# Altium project FPGA_Project.PrjPcb
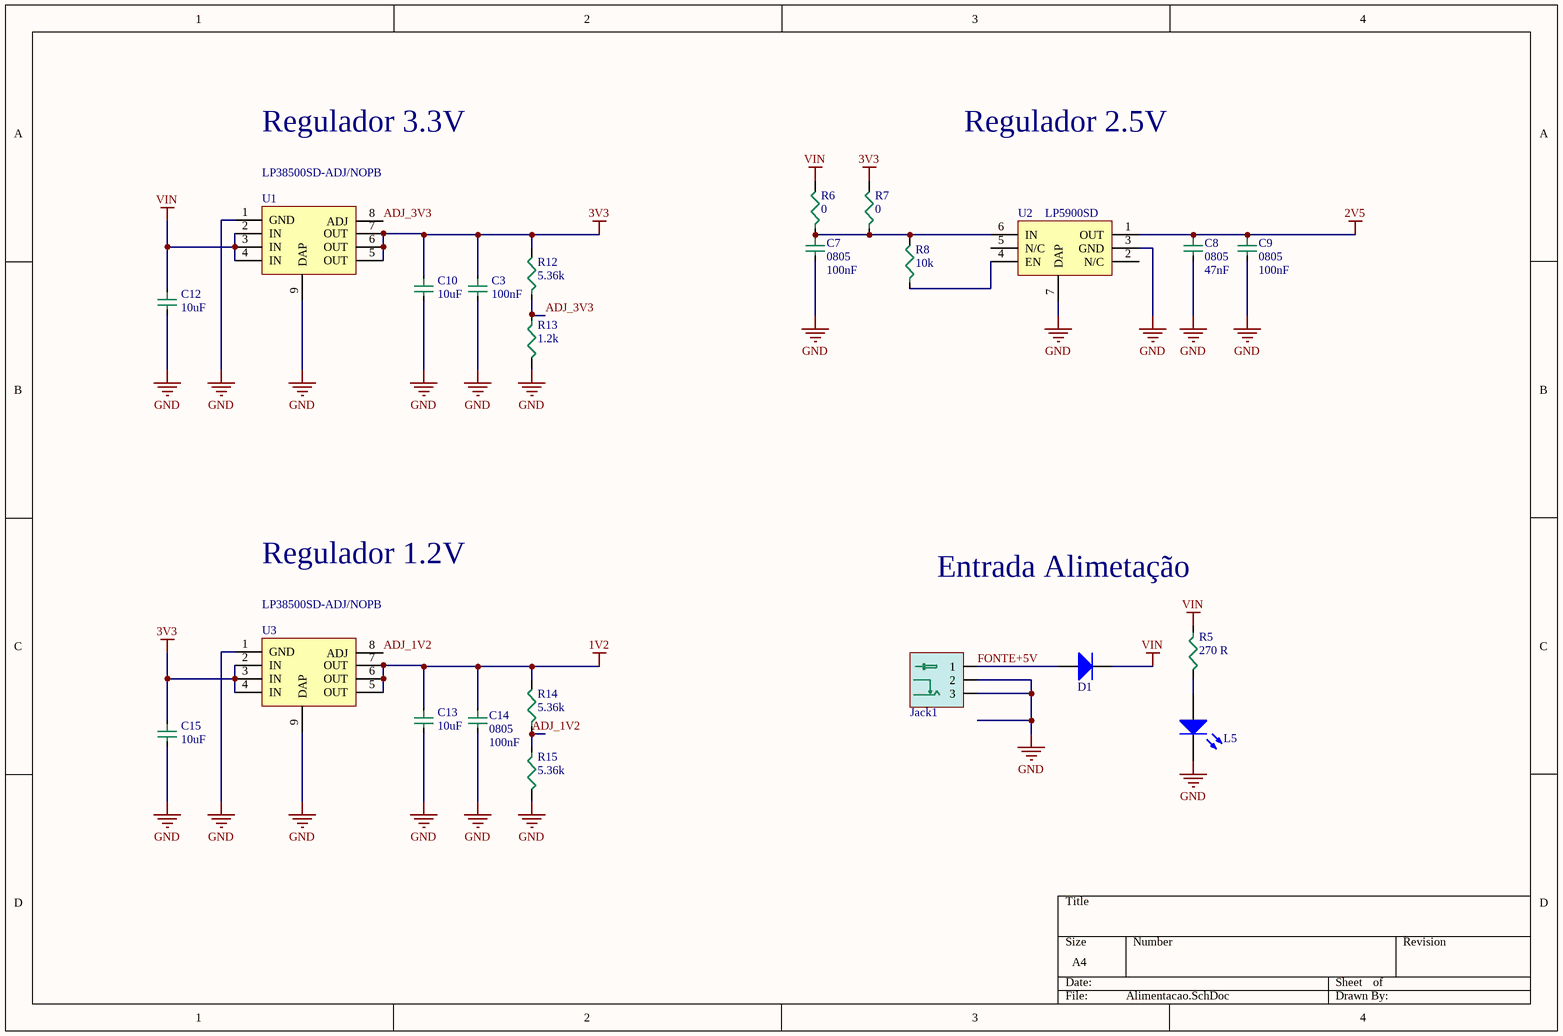
[diagram p0: Alimentacao.SchDoc]
5 sheets, 116 parts. Net scope: global (net labels, ports and power ports of the same name join across sheets).
Board files: PAINEL.PcbDoc, PCB1.PcbDoc
Sheets:
  Alimentacao.SchDoc
  DSP's.SchDoc
  FPGA.SchDoc
  Geral.SchDoc
  Perifericos_Schematic.SchDoc

## Sheet Alimentacao.SchDoc
size A4

### Parts
C3  value 100nF  [0603C]  (hidden comment: 0603)
C7  0805  value 100nF  [0603C]
C8  0805  value 47nF  [0603C]
C9  0805  value 100nF  [0603C]
C10  value 10uF  [0603C]  (hidden comment: 0603)
C12  value 10uF  [0603C]  (hidden comment: 0603)
C13  value 10uF  [0603C]  (hidden comment: 0603)
C14  0805  value 100nF  [0603C]
C15  value 10uF  [0603C]  (hidden comment: 0603)
D1  Diodo_1  [SOD123]  (value not drawn)
Jack1  DC Supply Jack  [CON_DC_POWER_JACK]  (value not drawn)
L5  LED 0805  [LED SMD 0603]  (value not drawn)
R5  value 270 R  [0603]  (hidden comment: 0805)
R6  value 0  [0603]  (hidden comment: 0805)
R7  value 0  [0603]  (hidden comment: 0805)
R8  value 10k  [0603]  (hidden comment: 0805)
R12  value 5.36k  [0603]  (hidden comment: 0805)
R13  value 1.2k  [0603]  (hidden comment: 0805)
R14  value 5.36k  [0603]  (hidden comment: 0805)
R15  value 5.36k  [0603]  (hidden comment: 0805)
U1  LP38500SD-ADJ/NOPB  [8-WFDFN]
U2  LP5900SD  [6-WFDFN]
U3  LP38500SD-ADJ/NOPB  [8-WFDFN]

### Nets
1V2: C13.1 C14.1 R14.2 U3.5(OUT) U3.6(OUT) U3.7(OUT)
2V5: C8.1 C9.1 U2.1(OUT)
3V3: C3.1 C10.1 C15.1 R7.2 R12.2 U1.5(OUT) U1.6(OUT) U1.7(OUT) U3.2(IN) U3.3(IN) U3.4(IN)
GND: C3.2 C7.2 C8.2 C9.2 C10.2 C12.2 C13.2 C14.2 C15.2 Jack1.2 Jack1.3 L5.2(K) R13.2 R15.2 U1.1(GND) U1.9(DAP) U2.3(GND) U2.7(DAP) U3.1(GND) U3.9(DAP)
VIN: C12.1 D1.2(K) R5.1 R6.2 U1.2(IN) U1.3(IN) U1.4(IN)
ADJ_1V2: R14.1 R15.1 U3.8(ADJ)
ADJ_3V3: R12.1 R13.1 U1.8(ADJ)
FONTE+5V: D1.1(A) Jack1.1
NetC7_1: C7.1 R6.1 R7.1 R8.2 U2.6(IN)
NetL5_1: L5.1(A) R5.2
NetR8_1: R8.1 U2.4(EN)

Not connected (* = marked no-connect by the designer): U2 2(N/C) 5(N/C)

### Notes on the sheet
- Regulador 3.3V
- Regulador 2.5V
- Regulador 1.2V
- Entrada Alimetação

### Library data of the parts
C3 C7-C10 C12-C15 = Capacitor SMD 0603
D1 = Diodo_1: DIODE SCHOTTKY 20V 0.5A SOD123; Supplier 1: Digi-Key; Supplier Part Number 1: MBR0520LCT-ND
Jack1 = DC_Power_connector
L5 = LED 0603 SMD: Typical INFRARED GaAs LED; Published: 8-Jun-2000; LatestRevisionDate: 08-Jul-2005; LatestRevisionNote: Mech Layer 1 removed.; PackageReference: LED-0; Publisher: Altium Limited
R5-R8 R12-R15 = Resistor SMD 0603 1/10 W: %: ±1%; P: 1/8W
U1 U3 = LP38500SD-ADJ/NOPB: 1.5-A Flexcap Low-Dropout Linear Regulator; Published: 26-Mar-2019; LatestRevisionDate: 26-Mar-2019; LatestRevisionNote: IPC-7351 Footprint Added.; DatasheetVersion: Sept-2015; PackageVersion: Nov-2007; PackageReference: e 8-WSON (3x2.5); Publisher: Altium Limited; PackageDescription: 8-WFDFN Exposed Pad; ComponentLink1Description: Manufacturer Link; ComponentLink1URL: http://www.ti.com/lit/ds/symlink/lp38500-adj.pdf
U2 = LP5900SD-2.5/NOPB: 1.5-A Flexcap Low-Dropout Linear Regulator; Published: 26-Mar-2019; LatestRevisionDate: 26-Mar-2019; LatestRevisionNote: IPC-7351 Footprint Added.; DatasheetVersion: june-2016; PackageVersion: Nov-2007; PackageReference: 6-WSON (3x2.5); Publisher: Altium Limited; PackageDescription: 6-WFDFN Exposed Pad; ComponentLink1Description: Manufacturer Link; ComponentLink1URL: http://www.ti.com/lit/ds/symlink/lp38500-adj.pdf

## Sheet DSP's.SchDoc
size A4
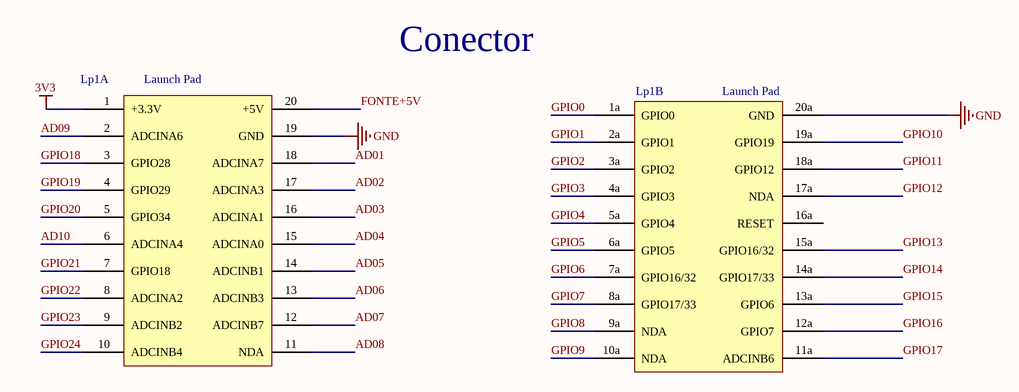
[diagram p1: DSP's.SchDoc]

### Parts
Lp1  Launch Pad  [LAUNCHPAD_28xxx]  (parts A,B of 2)

### Nets
3V3: Lp1.1(+3.3V)
GND: Lp1.19(GND) Lp1.20a(GND)
AD01: Lp1.18(ADCINA7)
AD02: Lp1.17(ADCINA3)
AD03: Lp1.16(ADCINA1)
AD04: Lp1.15(ADCINA0)
AD05: Lp1.14(ADCINB1)
AD06: Lp1.13(ADCINB3)
AD07: Lp1.12(ADCINB7)
AD08: Lp1.11(NDA)
AD09: Lp1.2(ADCINA6)
AD10: Lp1.6(ADCINA4)
FONTE+5V: Lp1.20(+5V)
GPIO0: Lp1.1a(GPIO0)
GPIO1: Lp1.2a(GPIO1)
GPIO2: Lp1.3a(GPIO2)
GPIO3: Lp1.4a(GPIO3)
GPIO4: Lp1.5a(GPIO4)
GPIO5: Lp1.6a(GPIO5)
GPIO6: Lp1.7a(GPIO16/32)
GPIO7: Lp1.8a(GPIO17/33)
GPIO8: Lp1.9a(NDA)
GPIO9: Lp1.10a(NDA)
GPIO10: Lp1.19a(GPIO19)
GPIO11: Lp1.18a(GPIO12)
GPIO12: Lp1.17a(NDA)
GPIO13: Lp1.15a(GPIO16/32)
GPIO14: Lp1.14a(GPIO17/33)
GPIO15: Lp1.13a(GPIO6)
GPIO16: Lp1.12a(GPIO7)
GPIO17: Lp1.11a(ADCINB6)
GPIO18: Lp1.3(GPIO28)
GPIO19: Lp1.4(GPIO29)
GPIO20: Lp1.5(GPIO34)
GPIO21: Lp1.7(GPIO18)
GPIO22: Lp1.8(ADCINA2)
GPIO23: Lp1.9(ADCINB2)
GPIO24: Lp1.10(ADCINB4)

Not connected (* = marked no-connect by the designer): Lp1 16a(RESET)

### Notes on the sheet
- Conector

### Library data of the parts
Lp1 = LaunchPad_28xxx

## Sheet FPGA.SchDoc
size A4
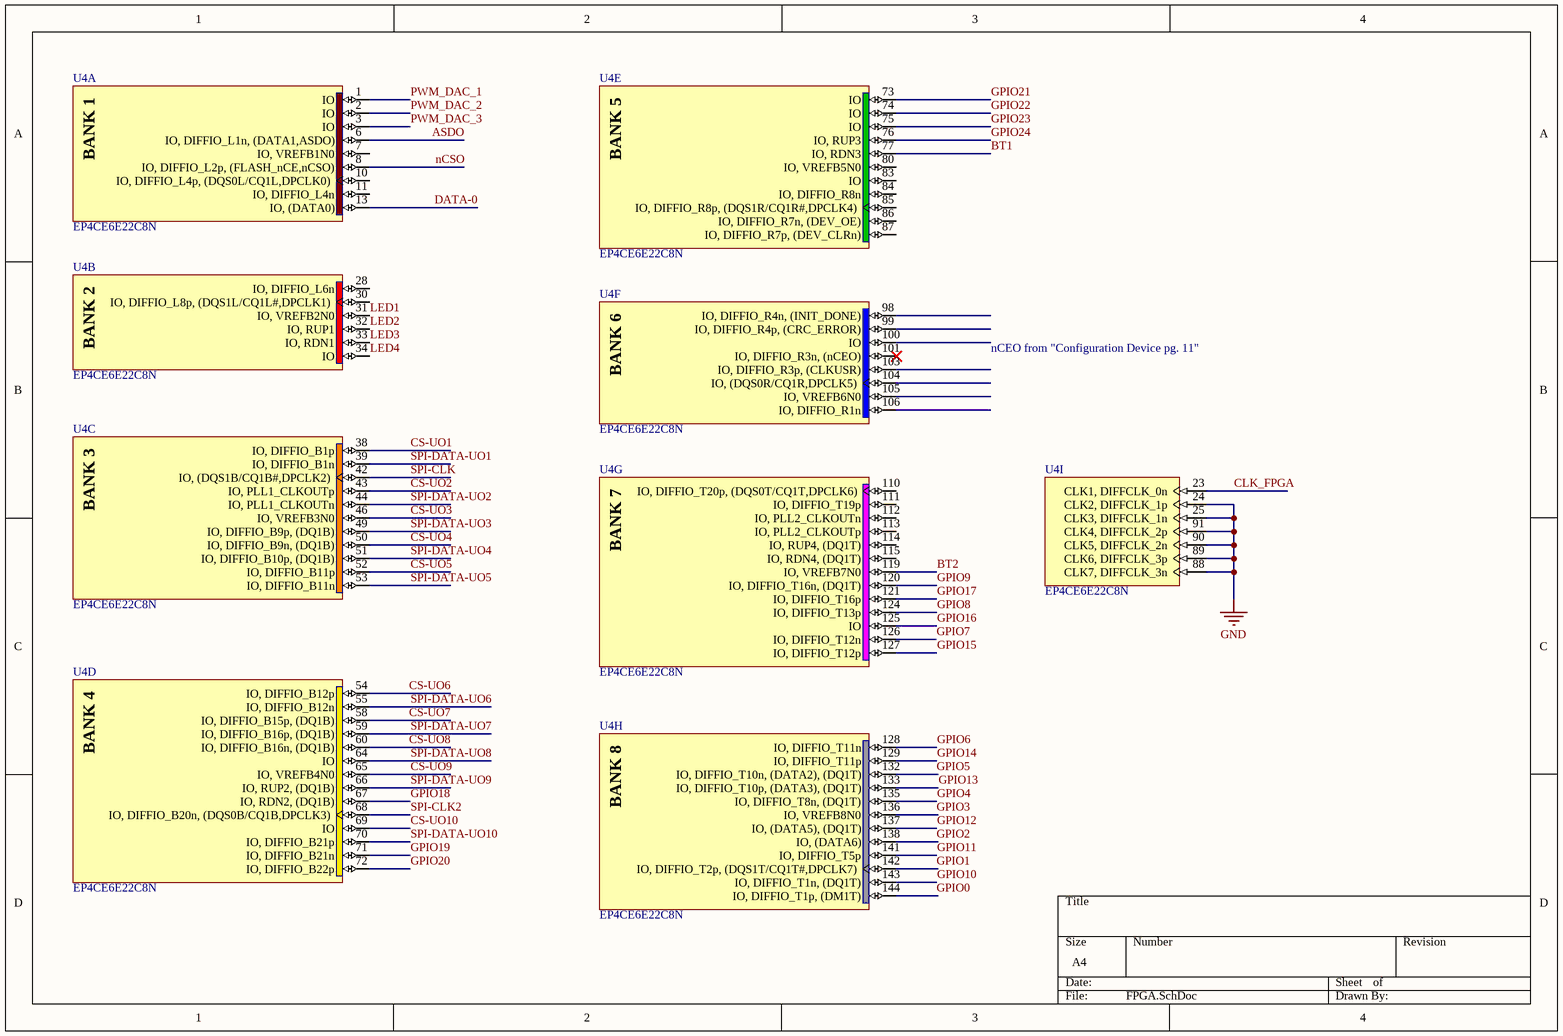
[diagram p2: FPGA.SchDoc]

### Parts
U4  EP4CE6E22C8N  [EQFP144_M]  (parts A,B,C,D,E,F,G,H,I of 13)

### Nets
GND: U4.24(CLK2,_DIFFCLK_1p) U4.25(CLK3,_DIFFCLK_1n) U4.88(CLK7,_DIFFCLK_3n) U4.89(CLK6,_DIFFCLK_3p) U4.90(CLK5,_DIFFCLK_2n) U4.91(CLK4,_DIFFCLK_2p)
ASDO: U4.6(IO,_DIFFIO_L1n,_(DATA1,ASDO))
BT1: U4.77(IO,_RDN3)
BT2: U4.119(IO,_VREFB7N0)
CLK_FPGA: U4.23(CLK1,_DIFFCLK_0n)
CS-UO1: U4.38(IO,_DIFFIO_B1p)
CS-UO2: U4.43(IO,_PLL1_CLKOUTp)
CS-UO3: U4.46(IO,_VREFB3N0)
CS-UO4: U4.50(IO,_DIFFIO_B9n,_(DQ1B))
CS-UO5: U4.52(IO,_DIFFIO_B11p)
CS-UO6: U4.54(IO,_DIFFIO_B12p)
CS-UO7: U4.58(IO,_DIFFIO_B15p,_(DQ1B))
CS-UO8: U4.60(IO,_DIFFIO_B16n,_(DQ1B))
CS-UO9: U4.65(IO,_VREFB4N0)
CS-UO10: U4.69(IO)
DATA-0: U4.13(IO,_(DATA0))
GPIO0: U4.144(IO,_DIFFIO_T1p,_(DM1T))
GPIO1: U4.142(IO,_DIFFIO_T2p,_(DQS1T/CQ1T#,DPCLK7))
GPIO2: U4.138(IO,_(DATA6))
GPIO3: U4.136(IO,_VREFB8N0)
GPIO4: U4.135(IO,_DIFFIO_T8n,_(DQ1T))
GPIO5: U4.132(IO,_DIFFIO_T10n,_(DATA2),_(DQ1T))
GPIO6: U4.128(IO,_DIFFIO_T11n)
GPIO7: U4.126(IO,_DIFFIO_T12n)
GPIO8: U4.124(IO,_DIFFIO_T13p)
GPIO9: U4.120(IO,_DIFFIO_T16n,_(DQ1T))
GPIO10: U4.143(IO,_DIFFIO_T1n,_(DQ1T))
GPIO11: U4.141(IO,_DIFFIO_T5p)
GPIO12: U4.137(IO,_(DATA5),_(DQ1T))
GPIO13: U4.133(IO,_DIFFIO_T10p,_(DATA3),_(DQ1T))
GPIO14: U4.129(IO,_DIFFIO_T11p)
GPIO15: U4.127(IO,_DIFFIO_T12p)
GPIO16: U4.125(IO)
GPIO17: U4.121(IO,_DIFFIO_T16p)
GPIO18: U4.67(IO,_RDN2,_(DQ1B))
GPIO19: U4.71(IO,_DIFFIO_B21n)
GPIO20: U4.72(IO,_DIFFIO_B22p)
GPIO21: U4.73(IO)
GPIO22: U4.74(IO)
GPIO23: U4.75(IO)
GPIO24: U4.76(IO,_RUP3)
LED1: U4.31(IO,_VREFB2N0)
LED2: U4.32(IO,_RUP1)
LED3: U4.33(IO,_RDN1)
LED4: U4.34(IO)
nCSO: U4.8(IO,_DIFFIO_L2p,_(FLASH_nCE,nCSO))
PWM_DAC_1: U4.1(IO)
PWM_DAC_2: U4.2(IO)
PWM_DAC_3: U4.3(IO)
SPI-CLK: U4.42(IO,_(DQS1B/CQ1B#,DPCLK2))
SPI-CLK2: U4.68(IO,_DIFFIO_B20n,_(DQS0B/CQ1B,DPCLK3))
SPI-DATA-UO1: U4.39(IO,_DIFFIO_B1n)
SPI-DATA-UO2: U4.44(IO,_PLL1_CLKOUTn)
SPI-DATA-UO3: U4.49(IO,_DIFFIO_B9p,_(DQ1B))
SPI-DATA-UO4: U4.51(IO,_DIFFIO_B10p,_(DQ1B))
SPI-DATA-UO5: U4.53(IO,_DIFFIO_B11n)
SPI-DATA-UO6: U4.55(IO,_DIFFIO_B12n)
SPI-DATA-UO7: U4.59(IO,_DIFFIO_B16p,_(DQ1B))
SPI-DATA-UO8: U4.64(IO)
SPI-DATA-UO9: U4.66(IO,_RUP2,_(DQ1B))
SPI-DATA-UO10: U4.70(IO,_DIFFIO_B21p)

Not connected (* = marked no-connect by the designer): U4 7(IO,_VREFB1N0) 10(IO,_DIFFIO_L4p,_(DQS0L/CQ1L,DPCLK0)) 11(IO,_DIFFIO_L4n) 28(IO,_DIFFIO_L6n) 30(IO,_DIFFIO_L8p,_(DQS1L/CQ1L#,DPCLK1)) 80(IO,_VREFB5N0) 83(IO) 84(IO,_DIFFIO_R8n) 85(IO,_DIFFIO_R8p,_(DQS1R/CQ1R#,DPCLK4)) 86(IO,_DIFFIO_R7n,_(DEV_OE)) 87(IO,_DIFFIO_R7p,_(DEV_CLRn)) 98(IO,_DIFFIO_R4n,_(INIT_DONE)) 99(IO,_DIFFIO_R4p,_(CRC_ERROR)) 100(IO) 101(IO,_DIFFIO_R3n,_(nCEO))* 103(IO,_DIFFIO_R3p,_(CLKUSR)) 104(IO,_(DQS0R/CQ1R,DPCLK5)) 105(IO,_VREFB6N0) 106(IO,_DIFFIO_R1n) 110(IO,_DIFFIO_T20p,_(DQS0T/CQ1T,DPCLK6)) 111(IO,_DIFFIO_T19p) 112(IO,_PLL2_CLKOUTn) 113(IO,_PLL2_CLKOUTp) 114(IO,_RUP4,_(DQ1T)) 115(IO,_RDN4,_(DQ1T))

### Notes on the sheet
- nCEO from "Configuration Device pg. 11"
- (in symbol EP4CE6E22C8N, part A) BANK 1
- (in symbol EP4CE6E22C8N, part B) BANK 2
- (in symbol EP4CE6E22C8N, part C) BANK 3
- (in symbol EP4CE6E22C8N, part D) BANK 4
- (in symbol EP4CE6E22C8N, part E) BANK 5
- (in symbol EP4CE6E22C8N, part F) BANK 6
- (in symbol EP4CE6E22C8N, part G) BANK 7
- (in symbol EP4CE6E22C8N, part H) BANK 8

### Library data of the parts
U4 = EP4CE6E22C8N: IC FPGA 91 I/O 144EQFP; Supplier 1: Digi-Key; Supplier Part Number 1: 544-2746-ND

## Sheet Geral.SchDoc
size A4
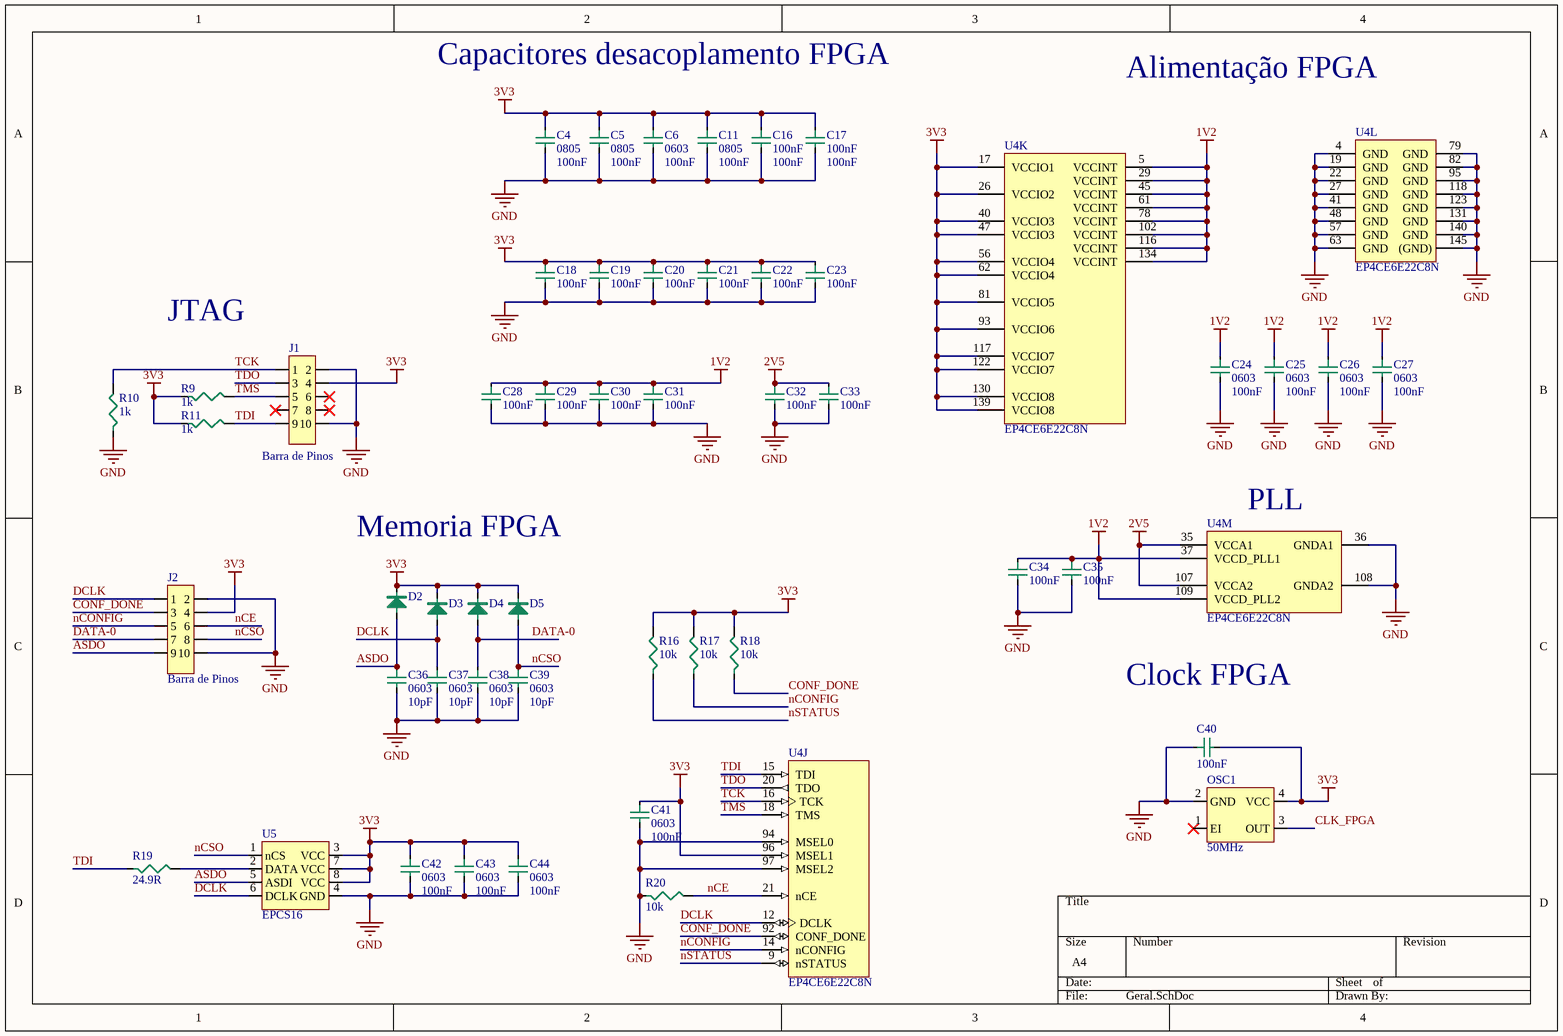
[diagram p3: Geral.SchDoc]

### Parts
C4  0805  value 100nF  [0603C]
C5  0805  value 100nF  [0603C]
C6  0603  value 100nF  [0603C]
C11  0805  value 100nF  [0603C]
C16  100nF  [0603C]
C17  100nF  [0603C]
C18  100nF  [0603C]
C19  100nF  [0603C]
C20  100nF  [0603C]
C21  100nF  [0603C]
C22  100nF  [0603C]
C23  100nF  [0603C]
C24  0603  value 100nF  [0603C]
C25  0603  value 100nF  [0603C]
C26  0603  value 100nF  [0603C]
C27  0603  value 100nF  [0603C]
C28  100nF  [0603C]
C29  100nF  [0603C]
C30  100nF  [0603C]
C31  100nF  [0603C]
C32  100nF  [0603C]
C33  100nF  [0603C]
C34  100nF  [0603C]
C35  100nF  [0603C]
C36  0603  value 10pF  [0603C]
C37  0603  value 10pF  [0603C]
C38  0603  value 10pF  [0603C]
C39  0603  value 10pF  [0603C]
C40  value 100nF  [0603C]  (hidden comment: 10pF)
C41  0603  value 100nF  [0603C]
C42  0603  value 100nF  [0603C]
C43  0603  value 100nF  [0603C]
C44  0603  value 100nF  [0603C]
D2  1N4148 SMD  [DIODE SMD LL-34]  (value not drawn)
D3  1N4148 SMD  [DIODE SMD LL-34]  (value not drawn)
D4  1N4148 SMD  [DIODE SMD LL-34]  (value not drawn)
D5  1N4148 SMD  [DIODE SMD LL-34]  (value not drawn)
J1  Barra de Pinos  [BPDC-10]
J2  Barra de Pinos  [BPDC-10]
OSC1  50MHz  [OSC CB3LV]
R9  value 1k  [0603]  (hidden comment: 0603)
R10  value 1k  [0603]  (hidden comment: 0603)
R11  value 1k  [0603]  (hidden comment: 0603)
R16  value 10k  [0603]  (hidden comment: 100R)
R17  value 10k  [0603]  (hidden comment: 1K)
R18  value 10k  [0603]  (hidden comment: 1K)
R19  value 24.9R  [0603]  (hidden comment: 1K)
R20  10K  [0603]
U4  EP4CE6E22C8N  [EQFP144_M]  (parts J,K,L,M of 13)
U5  EPCS16  [SOIC8]

### Nets
1V2: C24.1 C25.1 C26.1 C27.1 C28.2 C29.2 C30.2 C31.2 C34.2 C35.2 U4.5(VCCINT) U4.29(VCCINT) U4.37(VCCD_PLL1) U4.45(VCCINT) U4.61(VCCINT) U4.78(VCCINT) U4.102(VCCINT) U4.109(VCCD_PLL2) U4.116(VCCINT) U4.134(VCCINT)
2V5: C32.2 C33.2 U4.35(VCCA1) U4.107(VCCA2)
3V3: C4.1 C5.1 C6.1 C11.1 C16.2 C17.2 C18.2 C19.2 C20.2 C21.2 C22.2 C23.2 C40.2 C41.1 C42.1 C43.1 C44.1 D2.K D3.K D4.K D5.K J1.4 J2.4 OSC1.4(VCC) R9.1 R11.1 R16.2 R17.2 R18.2 U4.17(VCCIO1) U4.26(VCCIO2) U4.40(VCCIO3) U4.47(VCCIO3) U4.56(VCCIO4) U4.62(VCCIO4) U4.81(VCCIO5) U4.93(VCCIO6) U4.96(MSEL1) U4.117(VCCIO7) U4.122(VCCIO7) U4.130(VCCIO8) U4.139(VCCIO8) U5.3(VCC) U5.7(VCC) U5.8(VCC)
GND: C4.2 C5.2 C6.2 C11.2 C16.1 C17.1 C18.1 C19.1 C20.1 C21.1 C22.1 C23.1 C24.2 C25.2 C26.2 C27.2 C28.1 C29.1 C30.1 C31.1 C32.1 C33.1 C34.1 C35.1 C36.2 C37.2 C38.2 C39.2 C40.1 C41.2 C42.2 C43.2 C44.2 J1.2 J1.10 J2.2 J2.10 OSC1.2(GND) R10.1 R20.1 U4.4(GND) U4.19(GND) U4.22(GND) U4.27(GND) U4.36(GNDA1) U4.41(GND) U4.48(GND) U4.57(GND) U4.63(GND) U4.79(GND) U4.82(GND) U4.94(MSEL0) U4.95(GND) U4.97(MSEL2) U4.108(GNDA2) U4.118(GND) U4.123(GND) U4.131(GND) U4.140(GND) U4.145((GND)) U5.4(GND)
ASDO: C36.1 D2.A J2.9 U5.5(ASDI)
CLK_FPGA: OSC1.3(OUT)
CONF_DONE: J2.3 R18.1 U4.92(CONF_DONE)
DATA-0: C38.1 D4.A J2.7
DCLK: C37.1 D3.A J2.1 U4.12(DCLK) U5.6(DCLK)
nCE: J2.6 R20.2 U4.21(nCE)
nCONFIG: J2.5 R17.1 U4.14(nCONFIG)
nCSO: C39.1 D5.A J2.8 U5.1(nCS)
nSTATUS: R16.1 U4.9(nSTATUS)
TCK: J1.1 R10.2 U4.16(TCK)
TDI: J1.9 R11.2 R19.1 U4.15(TDI)
TDO: J1.3 U4.20(TDO)
TMS: J1.5 R9.2 U4.18(TMS)
NetR19_2: R19.2 U5.2(DATA)

Not connected (* = marked no-connect by the designer): J1 6* 7* 8*; OSC1 1(EI)*

### Notes on the sheet
- Capacitores desacoplamento FPGA
- Alimentação FPGA
- JTAG
- (near U4) PLL
- Memoria FPGA
- Clock FPGA

### Library data of the parts
C4-C6 C11 C16-C44 = Capacitor SMD 0603
  C16-C23 C28-C35: Value: 100nF
D2-D5 = Diodo Sinal SMD 1N4148: Diodo Sinal SMD LL-34
J1 J2 = Barra 5X2 Pinos PTH: Manufacturer: Metaltex; Manufacturer PN: BPSC-10; Distributor: Digikey
OSC1 = OSCILLATOR_INEP: OSC XO 50.00MHZ HCMOS TTL SMD; Supplier 1: Digi-Key; Supplier Part Number 1: CTX283LVCT-ND
R9-R11 R16-R20 = Resistor SMD 0603 1/10 W: %: ±1%; P: 1/8W
  R20: Value: 10k
U4 = EP4CE6E22C8N: IC FPGA 91 I/O 144EQFP; Supplier 1: Digi-Key; Supplier Part Number 1: 544-2746-ND
U5 = EPCS16SI8N: IC CONFIG DEVICE 16MBIT 8SOIC; Supplier 1: Digi-Key; Supplier Part Number 1: 544-2567-5-ND

## Sheet Perifericos_Schematic.SchDoc
size A4
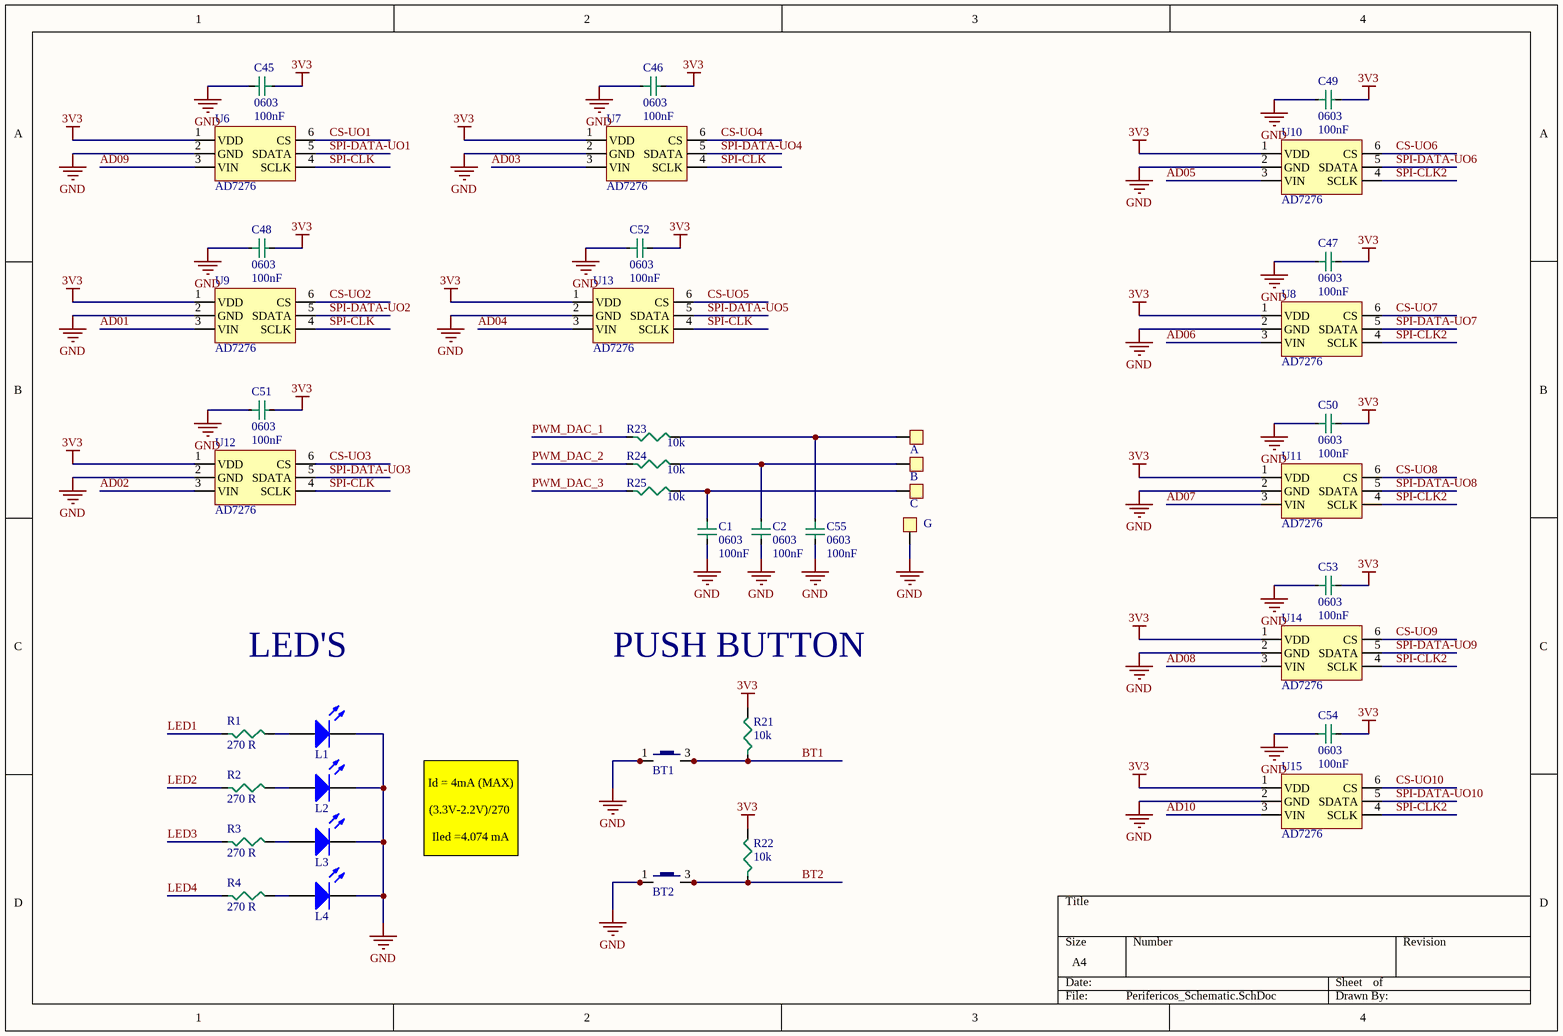
[diagram p4: Perifericos_Schematic.SchDoc]

### Parts
A  TEST POINT PC MINI .040"D, 0.010" x 0.020" (0.25mm x 0.51mm)  [PC test RED]  (value not drawn)
B  TEST POINT PC MINI .040"D, 0.010" x 0.020" (0.25mm x 0.51mm)  [PC test GREEN]  (value not drawn)
BT1  BOTAO SMD_MENOR  [BOTAO SMD - MENOR]  (value not drawn)
BT2  BOTAO SMD_MENOR  [BOTAO SMD - MENOR]  (value not drawn)
C  TEST POINT PC MINI .040"D, 0.010" x 0.020" (0.25mm x 0.51mm)  [PC test BLUE]  (value not drawn)
C1  0603  value 100nF  [0603C]
C2  0603  value 100nF  [0603C]
C45  0603  value 100nF  [0603C]
C46  0603  value 100nF  [0603C]
C47  0603  value 100nF  [0603C]
C48  0603  value 100nF  [0603C]
C49  0603  value 100nF  [0603C]
C50  0603  value 100nF  [0603C]
C51  0603  value 100nF  [0603C]
C52  0603  value 100nF  [0603C]
C53  0603  value 100nF  [0603C]
C54  0603  value 100nF  [0603C]
C55  0603  value 100nF  [0603C]
G  TEST POINT PC MINI .040"D, 0.010" x 0.020" (0.25mm x 0.51mm)  [PC test BLACK]  (value not drawn)
L1  LED 0603  [LED SMD 0603]  (value not drawn)
L2  LED 0805  [LED SMD 0603]  (value not drawn)
L3  LED 0805  [LED SMD 0603]  (value not drawn)
L4  LED 0805  [LED SMD 0603]  (value not drawn)
R1  value 270 R  [0603]  (hidden comment: 0603)
R2  value 270 R  [0603]  (hidden comment: 0805)
R3  value 270 R  [0603]  (hidden comment: 0805)
R4  value 270 R  [0603]  (hidden comment: 0805)
R21  value 10k  [0603]  (hidden comment: 0603)
R22  value 10k  [0603]  (hidden comment: 0603)
R23  value 10k  [0603]  (hidden comment: 0603)
R24  value 10k  [0603]  (hidden comment: 0603)
R25  value 10k  [0603]  (hidden comment: 0603)
U6  AD7276  [SOT23-6]
U7  AD7276  [SOT23-6]
U8  AD7276  [SOT23-6]
U9  AD7276  [SOT23-6]
U10  AD7276  [SOT23-6]
U11  AD7276  [SOT23-6]
U12  AD7276  [SOT23-6]
U13  AD7276  [SOT23-6]
U14  AD7276  [SOT23-6]
U15  AD7276  [SOT23-6]

### Nets
3V3: C45.1 C46.2 C47.2 C48.2 C49.2 C50.2 C51.2 C52.2 C53.2 C54.2 R21.2 R22.2 U6.1(VDD) U7.1(VDD) U8.1(VDD) U9.1(VDD) U10.1(VDD) U11.1(VDD) U12.1(VDD) U13.1(VDD) U14.1(VDD) U15.1(VDD)
GND: BT1.1 BT1.2 BT2.1 BT2.2 C1.2 C2.2 C45.2 C46.1 C47.1 C48.1 C49.1 C50.1 C51.1 C52.1 C53.1 C54.1 C55.2 G.1 L1.2(K) L2.2(K) L3.2(K) L4.2(K) U6.2(GND) U7.2(GND) U8.2(GND) U9.2(GND) U10.2(GND) U11.2(GND) U12.2(GND) U13.2(GND) U14.2(GND) U15.2(GND)
AD01: U9.3(VIN)
AD02: U12.3(VIN)
AD03: U7.3(VIN)
AD04: U13.3(VIN)
AD05: U10.3(VIN)
AD06: U8.3(VIN)
AD07: U11.3(VIN)
AD08: U14.3(VIN)
AD09: U6.3(VIN)
AD10: U15.3(VIN)
BT1: BT1.3 BT1.4 R21.1
BT2: BT2.3 BT2.4 R22.1
CS-UO1: U6.6(CS)
CS-UO2: U9.6(CS)
CS-UO3: U12.6(CS)
CS-UO4: U7.6(CS)
CS-UO5: U13.6(CS)
CS-UO6: U10.6(CS)
CS-UO7: U8.6(CS)
CS-UO8: U11.6(CS)
CS-UO9: U14.6(CS)
CS-UO10: U15.6(CS)
LED1: R1.1
LED2: R2.1
LED3: R3.1
LED4: R4.1
PWM_DAC_1: R23.1
PWM_DAC_2: R24.1
PWM_DAC_3: R25.1
SPI-CLK: U6.4(SCLK) U7.4(SCLK) U9.4(SCLK) U12.4(SCLK) U13.4(SCLK)
SPI-CLK2: U8.4(SCLK) U10.4(SCLK) U11.4(SCLK) U14.4(SCLK) U15.4(SCLK)
SPI-DATA-UO1: U6.5(SDATA)
SPI-DATA-UO2: U9.5(SDATA)
SPI-DATA-UO3: U12.5(SDATA)
SPI-DATA-UO4: U7.5(SDATA)
SPI-DATA-UO5: U13.5(SDATA)
SPI-DATA-UO6: U10.5(SDATA)
SPI-DATA-UO7: U8.5(SDATA)
SPI-DATA-UO8: U11.5(SDATA)
SPI-DATA-UO9: U14.5(SDATA)
SPI-DATA-UO10: U15.5(SDATA)
NetA_1: A.1 C55.1 R23.2
NetB_1: B.1 C2.1 R24.2
NetC_1: C.1 C1.1 R25.2
NetL1_1: L1.1(A) R1.2
NetL2_1: L2.1(A) R2.2
NetL3_1: L3.1(A) R3.2
NetL4_1: L4.1(A) R4.2

### Notes on the sheet
- LED'S
- (near R21) PUSH BUTTON
- Id = 4mA (MAX)
  (3.3V-2.2V)/270
  Iled =4.074 mA

### Library data of the parts
A B C G = Test Point Keystone: PC Test Point, Miniature Phosphor Bronze, Silver Plating 0.040" (1.02mm) Hole Diameter Mounting Type; ComponentLink1Description: Digikey; ComponentLink1URL: https://www.digikey.com/product-detail/en/keystone-electronics/5000/36-5000-ND/255326
BT1 BT2 = BOTAO SMD_MENOR: SWITCH TACTILE SPST-NO 0.05A 32V; Supplier 1: Digi-Key; Supplier Part Number 1: CKN10244CT-ND
C1 C2 C45-C55 = Capacitor SMD 0603
L1-L4 = LED 0603 SMD: Typical INFRARED GaAs LED; Published: 8-Jun-2000; LatestRevisionDate: 08-Jul-2005; LatestRevisionNote: Mech Layer 1 removed.; PackageReference: LED-0; Publisher: Altium Limited
R1-R4 R21-R25 = Resistor SMD 0603 1/10 W: %: ±1%; P: 1/8W
U6-U15 = AD7276AUJZ-500RL7: IC ADC 12BIT 3MSPS 6TSOT; Supplier 1: Digi-Key; Supplier Part Number 1: AD7276AUJZ-500RL7CT-ND

## Nets that join several sheets
1V2: Alimentacao (6 pins), Geral (20 pins)
2V5: Alimentacao (C8.1 C9.1 U2.1), Geral (C32.2 C33.2 U4.35 U4.107)
3V3: Alimentacao (11 pins), DSP's (Lp1.1), Geral (45 pins), Perifericos_Schematic (22 pins)
GND: Alimentacao (20 pins), DSP's (Lp1.19 Lp1.20a), FPGA (6 pins), Geral (61 pins), Perifericos_Schematic (32 pins)
AD01: DSP's (Lp1.18), Perifericos_Schematic (U9.3)
AD02: DSP's (Lp1.17), Perifericos_Schematic (U12.3)
AD03: DSP's (Lp1.16), Perifericos_Schematic (U7.3)
AD04: DSP's (Lp1.15), Perifericos_Schematic (U13.3)
AD05: DSP's (Lp1.14), Perifericos_Schematic (U10.3)
AD06: DSP's (Lp1.13), Perifericos_Schematic (U8.3)
AD07: DSP's (Lp1.12), Perifericos_Schematic (U11.3)
AD08: DSP's (Lp1.11), Perifericos_Schematic (U14.3)
AD09: DSP's (Lp1.2), Perifericos_Schematic (U6.3)
AD10: DSP's (Lp1.6), Perifericos_Schematic (U15.3)
ASDO: FPGA (U4.6), Geral (C36.1 D2.A J2.9 U5.5)
BT1: FPGA (U4.77), Perifericos_Schematic (BT1.3 BT1.4 R21.1)
BT2: FPGA (U4.119), Perifericos_Schematic (BT2.3 BT2.4 R22.1)
CLK_FPGA: FPGA (U4.23), Geral (OSC1.3)
CS-UO1: FPGA (U4.38), Perifericos_Schematic (U6.6)
CS-UO2: FPGA (U4.43), Perifericos_Schematic (U9.6)
CS-UO3: FPGA (U4.46), Perifericos_Schematic (U12.6)
CS-UO4: FPGA (U4.50), Perifericos_Schematic (U7.6)
CS-UO5: FPGA (U4.52), Perifericos_Schematic (U13.6)
CS-UO6: FPGA (U4.54), Perifericos_Schematic (U10.6)
CS-UO7: FPGA (U4.58), Perifericos_Schematic (U8.6)
CS-UO8: FPGA (U4.60), Perifericos_Schematic (U11.6)
CS-UO9: FPGA (U4.65), Perifericos_Schematic (U14.6)
CS-UO10: FPGA (U4.69), Perifericos_Schematic (U15.6)
DATA-0: FPGA (U4.13), Geral (C38.1 D4.A J2.7)
FONTE+5V: Alimentacao (D1.1 Jack1.1), DSP's (Lp1.20)
GPIO0: DSP's (Lp1.1a), FPGA (U4.144)
GPIO1: DSP's (Lp1.2a), FPGA (U4.142)
GPIO2: DSP's (Lp1.3a), FPGA (U4.138)
GPIO3: DSP's (Lp1.4a), FPGA (U4.136)
GPIO4: DSP's (Lp1.5a), FPGA (U4.135)
GPIO5: DSP's (Lp1.6a), FPGA (U4.132)
GPIO6: DSP's (Lp1.7a), FPGA (U4.128)
GPIO7: DSP's (Lp1.8a), FPGA (U4.126)
GPIO8: DSP's (Lp1.9a), FPGA (U4.124)
GPIO9: DSP's (Lp1.10a), FPGA (U4.120)
GPIO10: DSP's (Lp1.19a), FPGA (U4.143)
GPIO11: DSP's (Lp1.18a), FPGA (U4.141)
GPIO12: DSP's (Lp1.17a), FPGA (U4.137)
GPIO13: DSP's (Lp1.15a), FPGA (U4.133)
GPIO14: DSP's (Lp1.14a), FPGA (U4.129)
GPIO15: DSP's (Lp1.13a), FPGA (U4.127)
GPIO16: DSP's (Lp1.12a), FPGA (U4.125)
GPIO17: DSP's (Lp1.11a), FPGA (U4.121)
GPIO18: DSP's (Lp1.3), FPGA (U4.67)
GPIO19: DSP's (Lp1.4), FPGA (U4.71)
GPIO20: DSP's (Lp1.5), FPGA (U4.72)
GPIO21: DSP's (Lp1.7), FPGA (U4.73)
GPIO22: DSP's (Lp1.8), FPGA (U4.74)
GPIO23: DSP's (Lp1.9), FPGA (U4.75)
GPIO24: DSP's (Lp1.10), FPGA (U4.76)
LED1: FPGA (U4.31), Perifericos_Schematic (R1.1)
LED2: FPGA (U4.32), Perifericos_Schematic (R2.1)
LED3: FPGA (U4.33), Perifericos_Schematic (R3.1)
LED4: FPGA (U4.34), Perifericos_Schematic (R4.1)
nCSO: FPGA (U4.8), Geral (C39.1 D5.A J2.8 U5.1)
PWM_DAC_1: FPGA (U4.1), Perifericos_Schematic (R23.1)
PWM_DAC_2: FPGA (U4.2), Perifericos_Schematic (R24.1)
PWM_DAC_3: FPGA (U4.3), Perifericos_Schematic (R25.1)
SPI-CLK: FPGA (U4.42), Perifericos_Schematic (5 pins)
SPI-CLK2: FPGA (U4.68), Perifericos_Schematic (5 pins)
SPI-DATA-UO1: FPGA (U4.39), Perifericos_Schematic (U6.5)
SPI-DATA-UO2: FPGA (U4.44), Perifericos_Schematic (U9.5)
SPI-DATA-UO3: FPGA (U4.49), Perifericos_Schematic (U12.5)
SPI-DATA-UO4: FPGA (U4.51), Perifericos_Schematic (U7.5)
SPI-DATA-UO5: FPGA (U4.53), Perifericos_Schematic (U13.5)
SPI-DATA-UO6: FPGA (U4.55), Perifericos_Schematic (U10.5)
SPI-DATA-UO7: FPGA (U4.59), Perifericos_Schematic (U8.5)
SPI-DATA-UO8: FPGA (U4.64), Perifericos_Schematic (U11.5)
SPI-DATA-UO9: FPGA (U4.66), Perifericos_Schematic (U14.5)
SPI-DATA-UO10: FPGA (U4.70), Perifericos_Schematic (U15.5)